# Altium schematic sheet uC.SchDoc
size A4
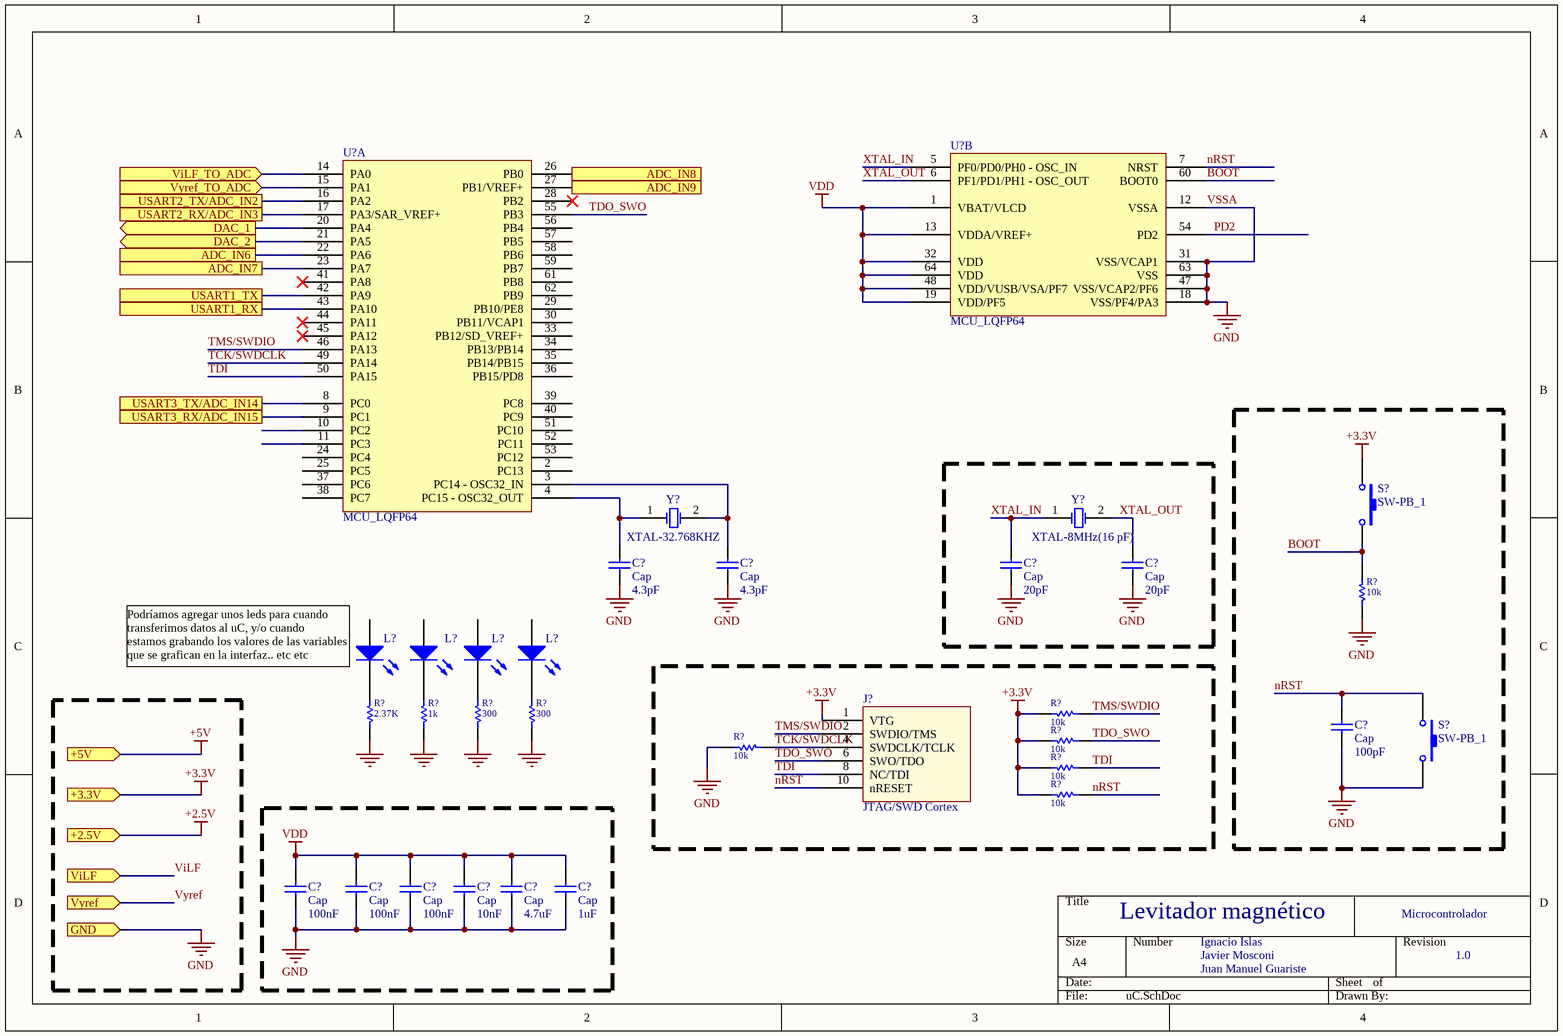
[diagram p0: uC.SchDoc]

## Parts
(Parts that share a designator on the sheet are numbered #1, #2 ... from top to bottom, then left to right.)
C?#1  Cap  value 4.3pF  [RAD-0.3]
C?#2  Cap  value 4.3pF  [RAD-0.3]
C?#3  Cap  value 20pF  [RAD-0.3]
C?#4  Cap  value 20pF  [RAD-0.3]
C?#5  Cap  value 100pF  [RAD-0.3]
C?#6  Cap  value 100nF  [RAD-0.3]
C?#7  Cap  value 100nF  [RAD-0.3]
C?#8  Cap  value 100nF  [RAD-0.3]
C?#9  Cap  value 10nF  [RAD-0.3]
C?#10  Cap  value 4.7uF  [RAD-0.3]
C?#11  Cap  value 1uF  [RAD-0.3]
J?  JTAG/SWD Cortex  [_HDR2X5]
L?#1  LED1  [LED 1206 RED]  (value not drawn)
L?#2  LED1  [LED 1206 RED]  (value not drawn)
L?#3  LED1  [LED 1206 RED]  (value not drawn)
L?#4  LED1  [LED 1206 RED]  (value not drawn)
R?#1  10k  [R1206]
R?#2  2.37K  [R1206]
R?#3  1k  [R1206]
R?#4  300  [R1206]
R?#5  300  [R1206]
R?#6  10k  [R1206]
R?#7  10k  [R1206]
R?#8  10k  [R1206]
R?#9  10k  [R1206]
R?#10  10k  [R1206]
S?#1  SW-PB_1  [SPST-NO SMD]
S?#2  SW-PB_1  [SPST-NO SMD]
U?#1  MCU_LQFP64  [LQFP64_M]  (part B of 2)
U?#2  MCU_LQFP64  [LQFP64_M]  (part A of 2)
Y?#1  XTAL-32.768KHZ  [R38]
Y?#2  XTAL-8MHz(16 pF)  [R38]

## Ports
+2.5V (in), +3.3V (in), +5V (in), ADC_IN6, ADC_IN7, ADC_IN8, ADC_IN9, DAC_1 (out), DAC_2 (out), GND (in), USART1_RX, USART1_TX, USART2_RX/ADC_IN3, USART2_TX/ADC_IN2, USART3_RX/ADC_IN15, USART3_TX/ADC_IN14, ViLF (in), ViLF_TO_ADC (in), Vyref (in), Vyref_TO_ADC (in)

## Nets
+2.5V: port +2.5V
+3.3V: J?.1(VTG) R?#6.2 R?#7.2 R?#9.2 R?#10.2 S?#1.1 ; port +3.3V
+5V: port +5V
VDD: C?#6.1 C?#7.1 C?#8.1 C?#9.1 C?#10.1 C?#11.1 U?#1.1(VBAT/VLCD) U?#1.13(VDDA/VREF+) U?#1.19(VDD/PF5) U?#1.32(VDD) U?#1.48(VDD/VUSB/VSA/PF7) U?#1.64(VDD)
VSSA: C?#1.2 C?#2.2 C?#3.2 C?#4.2 C?#5.2 C?#6.2 C?#7.2 C?#8.2 C?#9.2 C?#10.2 C?#11.2 J?.3(GND) J?.5(GND) J?.9(GND) R?#1.2 R?#2.1 R?#3.2 R?#4.1 R?#5.1 R?#8.2 S?#2.2 U?#1.12(VSSA) U?#1.18(VSS/PF4/PA3) U?#1.31(VSS/VCAP1) U?#1.47(VSS/VCAP2/PF6) U?#1.63(VSS) ; port GND  [also labelled GND]
ADC_IN6: U?#2.22(PA6) ; port ADC_IN6
ADC_IN7: U?#2.23(PA7) ; port ADC_IN7
ADC_IN8: U?#2.26(PB0) ; port ADC_IN8
ADC_IN9: U?#2.27(PB1/VREF+) ; port ADC_IN9
BOOT: R?#1.1 S?#1.2 U?#1.60(BOOT0)
DAC_1: U?#2.20(PA4) ; port DAC_1
DAC_2: U?#2.21(PA5) ; port DAC_2
nRST: C?#5.1 J?.10(nRESET) R?#10.1 S?#2.1 U?#1.7(NRST)
PD2: U?#1.54(PD2)
TCK/SWDCLK: J?.4(SWDCLK/TCLK) R?#8.1 U?#2.49(PA14)
TDI: J?.8(NC/TDI) R?#9.1 U?#2.50(PA15)
TDO_SWO: J?.6(SWO/TDO) R?#7.1 U?#2.55(PB3)
TMS/SWDIO: J?.2(SWDIO/TMS) R?#6.1 U?#2.46(PA13)
USART1_RX: U?#2.43(PA10) ; port USART1_RX
USART1_TX: U?#2.42(PA9) ; port USART1_TX
USART2_RX/ADC_IN3: U?#2.17(PA3/SAR_VREF+) ; port USART2_RX/ADC_IN3
USART2_TX/ADC_IN2: U?#2.16(PA2) ; port USART2_TX/ADC_IN2
USART3_RX/ADC_IN15: U?#2.9(PC1) ; port USART3_RX/ADC_IN15
USART3_TX/ADC_IN14: U?#2.8(PC0) ; port USART3_TX/ADC_IN14
ViLF: port ViLF
ViLF_TO_ADC: U?#2.14(PA0) ; port ViLF_TO_ADC
Vyref: port Vyref
Vyref_TO_ADC: U?#2.15(PA1) ; port Vyref_TO_ADC
XTAL_IN: C?#3.1 U?#1.5(PF0/PD0/PH0_-_OSC_IN) Y?#2.1(OSC1)
XTAL_OUT: C?#4.1 U?#1.6(PF1/PD1/PH1_-_OSC_OUT) Y?#2.2(OSC2)
NetC?#1_1: C?#1.1 U?#2.4(PC15_-_OSC32_OUT) Y?#1.1(OSC1)
NetC?#2_1: C?#2.1 U?#2.3(PC14_-_OSC32_IN) Y?#1.2(OSC2)
NetL?#1_2: L?#1.2(K) R?#2.2
NetL?#2_2: L?#2.2(K) R?#3.1
NetL?#3_2: L?#3.2(K) R?#4.2
NetL?#4_2: L?#4.2(K) R?#5.2

Not connected (* = marked no-connect by the designer): J? 7(NC); L?#1 1(A); L?#2 1(A); L?#3 1(A); L?#4 1(A); U?#2 2(PC13) 10(PC2) 11(PC3) 24(PC4) 25(PC5) 28(PB2)* 29(PB10/PE8) 30(PB11/VCAP1) 33(PB12/SD_VREF+) 34(PB13/PB14) 35(PB14/PB15) 36(PB15/PD8) 37(PC6) 38(PC7) 39(PC8) 40(PC9) 41(PA8)* 44(PA11)* 45(PA12)* 51(PC10) 52(PC11) 53(PC12) 56(PB4) 57(PB5) 58(PB6) 59(PB7) 61(PB8) 62(PB9)

## Notes on the sheet
- (near L?#1) Podríamos agregar unos leds para cuando transferimos datos al uC, y/o cuando
  estamos grabando los valores de las variables que se grafican en la interfaz.. etc etc
- Levitador magnético
- Microcontrolador
- Ignacio Islas
- Javier Mosconi
- Juan Manuel Guariste
- 1.0

## Library data of the parts
C?#1-C?#11 = Cap: Capacitor; Published: 8-Jun-2000; LatestRevisionDate: 17-Jul-2002; LatestRevisionNote: Re-released for DXP Platform.; PackageReference: RAD-0.3; Publisher: Altium Limited; PackageDescription: Radial Cap, Thru-Hole; 2 Leads; 0.3 in Pin Spacing
L?#1-L?#4 = LED1: Typical RED GaAs LED; Published: 8-Jun-2000; LatestRevisionDate: 08-Jul-2005; LatestRevisionNote: Mech Layer 1 removed.; PackageReference: LED-1; Publisher: Altium Limited
R?#1-R?#10 = R1206: Resistor Chip; 1/8W;; Published: 8-Jun-2000; LatestRevisionDate: 26/8/2013; PackageReference: 1206; Publisher: Altium Limited; PackageDescription: SMT Chip Resistor; Supplier 1: Digi-Key
  R?#1 R?#6-R?#10: Value: 10k
  R?#2: Value: 2.37K
  R?#3: Value: 1k
  R?#4 R?#5: Value: 300
S?#1 S?#2 = SW-PB_1: Switch; Published: 24-Mar-1999; LatestRevisionDate: 17-Jul-2002; LatestRevisionNote: Re-released for DXP Platform.; PackageReference: SPST-2; Publisher: Altium Limited; PackageDescription: Switch; 2 Leads
U?#1 U?#2 = MCU_LQFP64: STM32F072RB
Y?#1 Y?#2 = XTAL: Crystal Oscillator; Published: 8-Jun-2000; LatestRevisionDate: 17-Jul-2002; LatestRevisionNote: Re-released for DXP Platform.; PackageReference: R38; Publisher: Altium Limited; PackageDescription: Crystal, Thru-Hole; 2 Leads; Body 3.1 x 8.2 mm (Dia.xH)